# Altium project Blue Tractor_v1.1-2021.PrjPCB (part 2 of 2)

## Sheet [09] - EMC-Power.SchDoc
size A3; PageSetup: Record=PageOptions|CenterHorizontal=True|CenterVertical=True|PrintScale=0.94|XCorrection=1.00|YCorrection=1.00|PrintKind=1|BorderSize=5000000|LeftOffset=0|BottomOffset=0|Orientation=1|PaperLength=1000|PaperWidth=1000|Scale=100|PaperSource=7|PrintQuality=-4|MediaType=1|DitherType=10|PaperKind=A4|PrintScaleMode=1; DecimalNumber: Децимальный номер; HeadOfSector: Нач. сектора; MainDevice: Перв.примен.; Name: Наименование
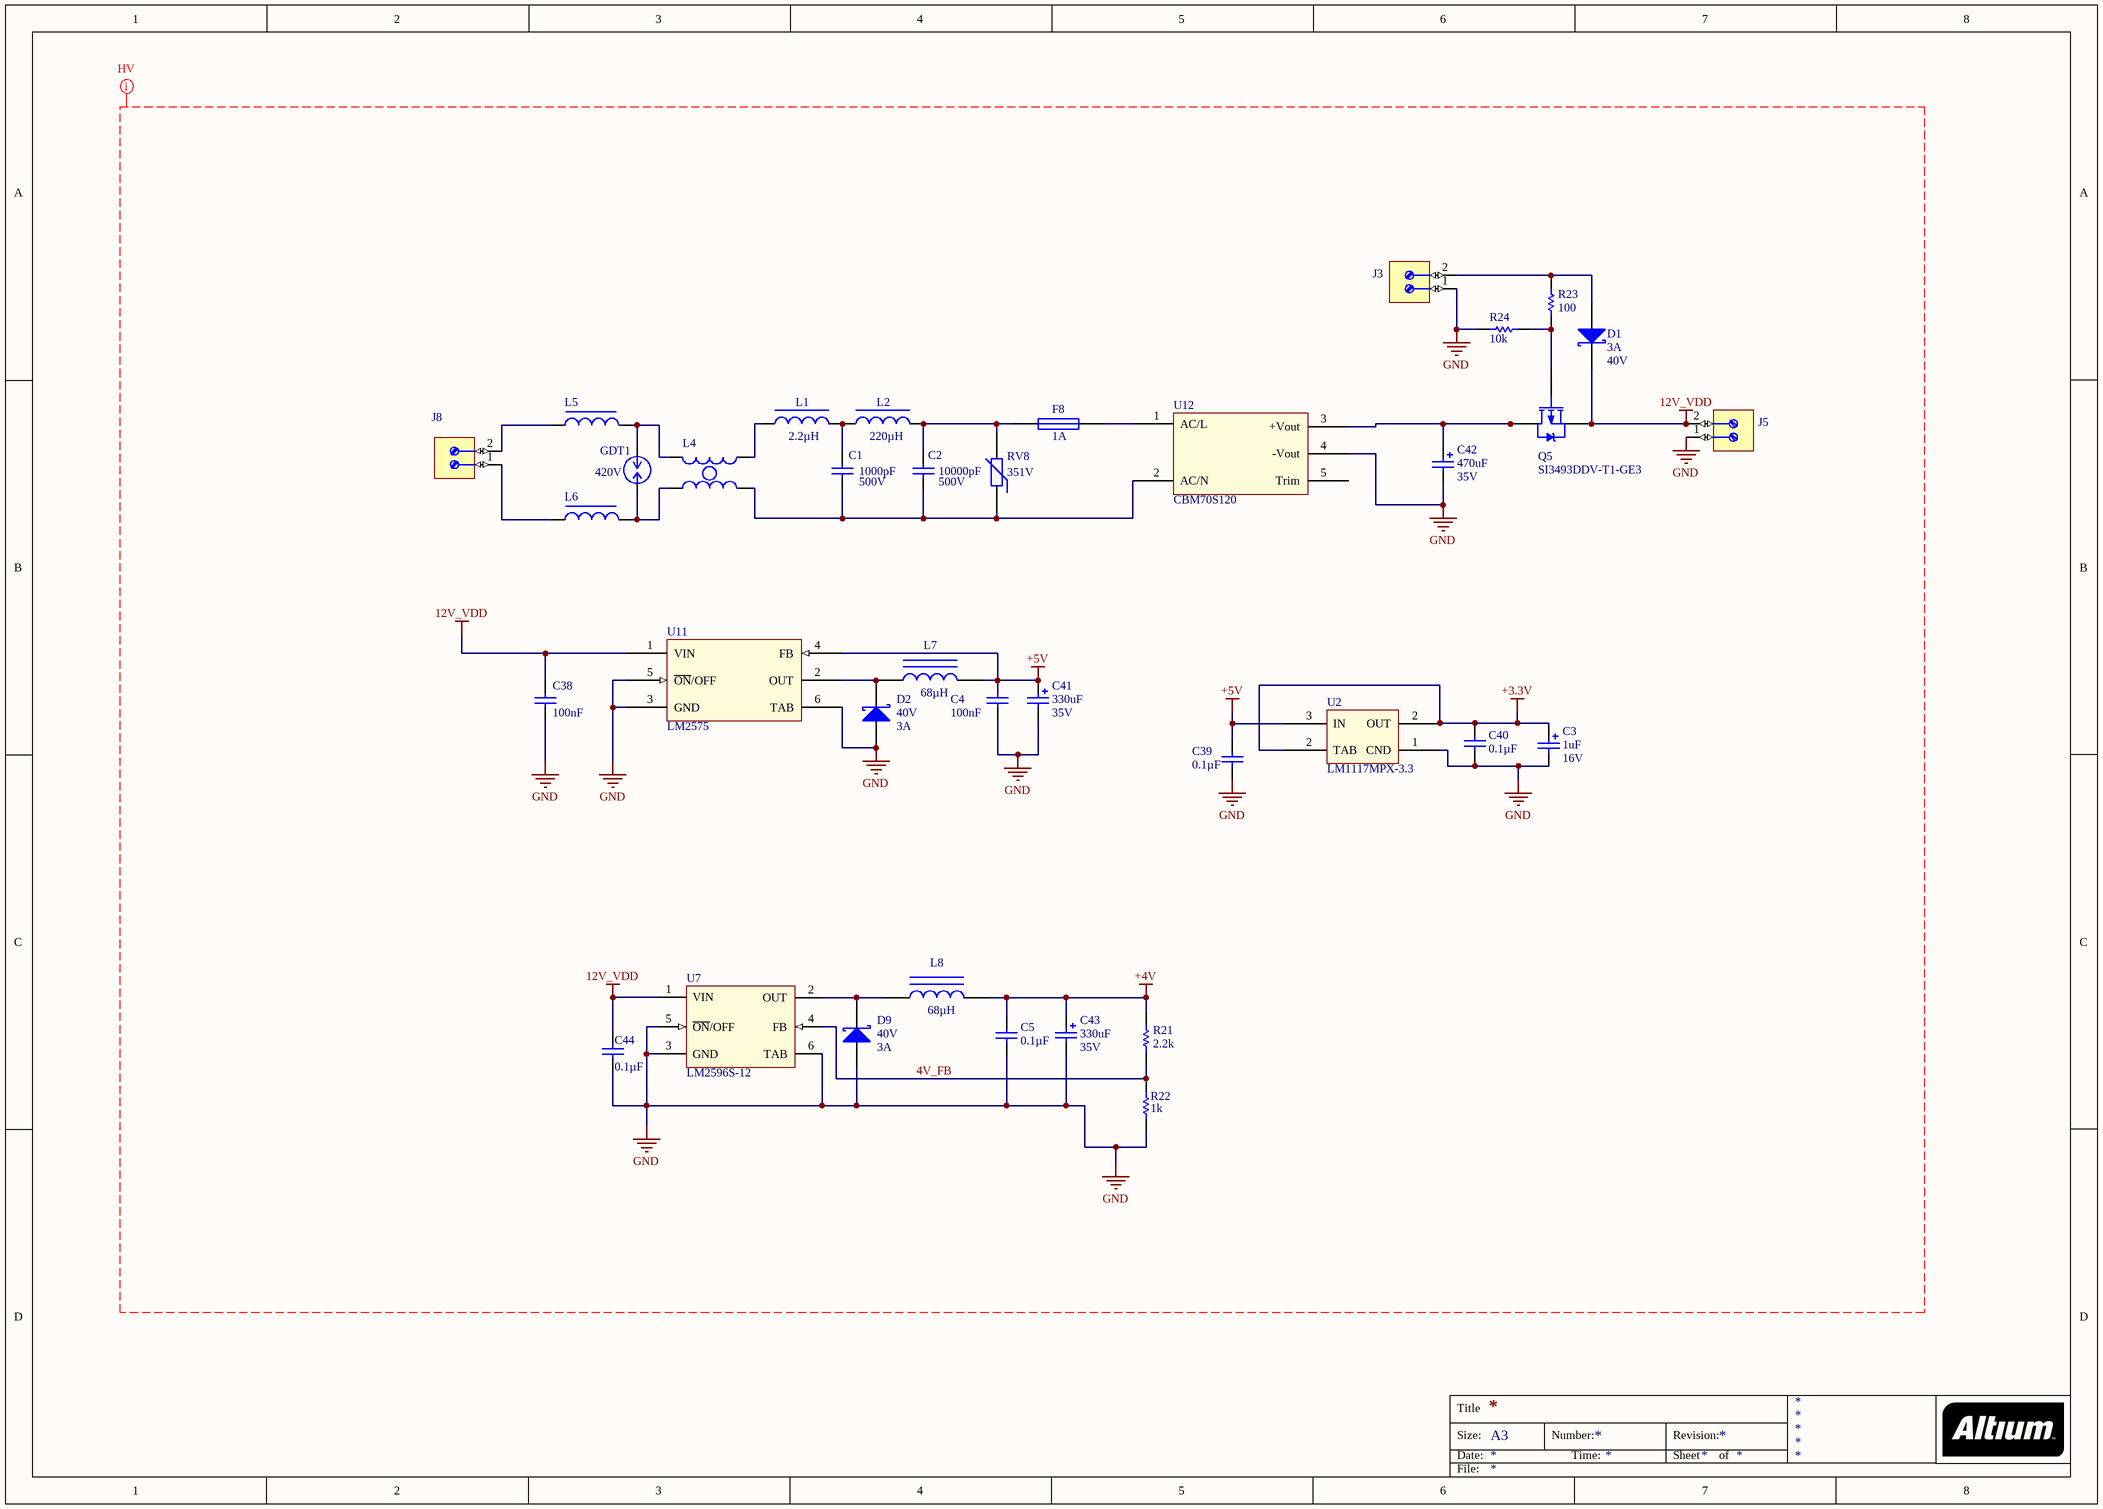
[diagram p5: [09] - EMC-Power.SchDoc]

### Parts
C1  Capacitance: 1000pF  Voltage - Rated: 500V  [CAPASITOR_1206]  (hidden comment: Capacitor)
C2  Capacitance: 10000pF  Voltage - Rated: 500V  [CAPASITOR_1206]  (hidden comment: Capacitor)
C3  Capacitance: 1uF  Voltage Rating: 16V  [Tantalum 3216 A]  (hidden comment: Capacitor Polarized)
C4  Capacitance: 100nF  [0603_C]  (hidden comment: Capacitor)
C5  Capacitance: 0.1µF  [0603_C]  (hidden comment: Capacitor)
C38  value 100nF  [0603_C]  (hidden comment: Capacitor)
C39  Capacitance: 0.1µF  [0603_C]  (hidden comment: Capacitor)
C40  Capacitance: 0.1µF  [0603_C]  (hidden comment: Capacitor)
C41  Capacitance: 330uF  Voltage: 35V  [Aluminium SMD G]  (hidden comment: Capacitor Polarized)
C42  Capacitance: 470uF  Voltage Rating: 35V  [Aluminium SMD G]  (hidden comment: Capacitor Polarized)
C43  Capacitance: 330uF  Voltage: 35V  [Aluminium SMD G]  (hidden comment: Capacitor Polarized)
C44  Capacitance: 0.1µF  [0603_C]  (hidden comment: Capacitor)
D1  Output Current: 3A  Voltage: 40V  [D-Schottky]  (hidden comment: SK32)
D2  Output Current: 3A  Voltage: 40V  [D-Schottky]  (hidden comment: SK32)
D9  Output Current: 3A  Voltage: 40V  [D-Schottky]  (hidden comment: SK32)
F8  value 1A  [FUSR_LITTELFUSE_2920L]  (hidden comment: Fuse)
GDT1  Voltage - DC Spark Over (Nom): 420V  [GTCA28_TYCO_TYC]  (hidden comment: Gas Discharge Tube)
J3  (no value)  [Connector -PHOENIX_1715721]
J5  (no value)  [Connector -PHOENIX_1715721]
J8  (no value)  [Connector -PHOENIX_1715721]
L1  Inductance: 2.2µH  [? INDUCTOR_TDK]  (hidden comment: Inductor)
L2  Inductance: 220µH  [L8 -INDUCTOR_BOURNS_SRR1260]  (hidden comment: Inductor)
L4  RN114-1-02 Current-compensated Chokes  [IND: RN152]  (value not drawn)
L5  Inductor_BFB20022-4B-RC-ND  [INDUCTOR FB20022]  (value not drawn)
L6  Inductor_BFB20022-4B-RC-ND  [INDUCTOR FB20022]  (value not drawn)
L7  Inductance: 68µH  [L8 -INDUCTOR_BOURNS_SRR1260]  (hidden comment: SRR1210)
L8  Inductance: 68µH  [L8 -INDUCTOR_BOURNS_SRR1260]  (hidden comment: SRR1210)
Q5  Manufacturer Part Number: SI3493DDV-T1-GE3  [SOT23-6]  (hidden comment: PMOSFET)
R21  Resistance: 2.2k  [0603_R]  (hidden comment: Res1)
R22  Resistance: 1k  [0603_R]  (hidden comment: Res1)
R23  Resistance: 100  [0603_R]  (hidden comment: Res1)
R24  Resistance: 10k  [0603_R]  (hidden comment: Res1)
RV8  Varistor Voltage (Min): 351V  [VARS_B72214S0271K101_TDK]  (hidden comment: Res Varistor)
U2  LM1117MPX-3.3  [LM1117IMPX-3.3]
U7  LM2596S-12  [TO-263-5]
U11  LM2575  [TO-263-5]
U12  CBM70S120  [MOD: CBM70S]

### Nets
12V_VDD: C38.2 C44.2 D1.2(K) J5.2 Q5.4(S) U7.1(VIN) U11.1(VIN)
+3.3V: C3.1 C40.2 U2.2(TAB)
+4V: C5.2 C43.1 L8.2 R21.1
+5V: C4.2 C39.2 C41.1 L7.2 U2.3(IN) U11.4(FB)
GND: C3.2 C4.1 C5.1 C38.1 C39.1 C40.1 C41.2 C42.2 C43.2 C44.1 D2.1(A) D9.1(A) J3.1 J5.1 R22.1 R24.2 U2.1(CND) U7.3(GND) U7.5(~{ON}/OFF) U7.6(TAB) U11.3(GND) U11.5(~{ON}/OFF) U11.6(TAB) U12.4(-Vout)
4V_FB: R21.2 R22.2 U7.4(FB)
NetC1_1: C1.1 C2.1 L4.2 RV8.1 U12.2(AC/N)
NetC1_2: C1.2 L1.2 L2.1
NetC2_2: C2.2 F8.1 L2.2 RV8.2
NetC42_1: C42.1 Q5.1(D) Q5.2(D) Q5.5(D) Q5.6(D) U12.3(+Vout)
NetD1_1: D1.1(A) J3.2 R23.1
NetD2_2: D2.2(K) L7.1 U11.2(OUT)
NetD9_2: D9.2(K) L8.1 U7.2(OUT)
NetF8_2: F8.2 U12.1(AC/L)
NetGDT1_1: GDT1.1 L4.3 L5.2
NetGDT1_2: GDT1.2 L4.1 L6.2
NetJ8_1: J8.1 L6.1
NetJ8_2: J8.2 L5.1
NetL1_1: L1.1 L4.4
NetQ5_3: Q5.3(G) R23.2 R24.1

Not connected (* = marked no-connect by the designer): U12 5(Trim)

### Layout directives
net class HV: 4V_FB, 12V_VDD, +3.3V, +4V, +5V, GND

### Notes on the sheet
- Title
- Size:
- Date:
- A3
- Number:
- Time:
- Revision:
- Sheet
- of
- File:

### Library data of the parts
C1 = 1: Chip Capacitor Nonpolar; Manufacturer: Samsung Electro-Mechanics America, Inc; Manufacturer Part Number: CL31B102KGFNFNE; ID: 1; Lybrary Path: Capacitors.SchLib; Tolerance: ±10%; Temperature Coefficient: X7R; Published: 8-Jun-2000; LatestRevisionDate: 17-Jul-2002; LatestRevisionNote: Re-released for DXP Platform.; PackageReference: RAD-0.3; Publisher: Altium Limited; PackageDescription: Radial Cap, Thru-Hole; 2 Leads; 0.3 in Pin Spacing; Supplier 1: Digi-Key; Supplier Part Number 1: 1276-3065-1-ND; RoHS: RoHS Compliant; Category: Capacitors; Stock 1: 2501; Pricing 1: 1=0.19, 10=0.126, 25=0.092, 100=0.0643, 500=0.0459, 1000=0.03902 (USD); Packaging: Cut Tape (CT); Mounting Type: Surface Mount, MLCC; Operating Temperature: -55°C ~ 125°C; Applications: General Purpose; Ratings: -; Package / Case: 1206 (3216 Metric); Size / Dimension: 0.126" L x 0.063" W (3.20mm x 1.60mm); Height - Seated (Max): -; Thickness (Max): 0.055" (1.40mm); Lead Spacing: -; Features: -; Lead Style: -; ComponentLink1URL: http://www.samsungsem.com/kr/front/downloadcms.do?path=/kr/support/product-search/mlcc/__icsFiles/afieldfile/2014/11/05&fileName=S_CL31B102KGFNFNE.pdf; ComponentLink1Description: http://www.samsungsem.com/kr/front/downloadcms.do?path=/kr/support/product-search/mlcc/__icsFiles/afieldfile/2014/11/05&fileName=S_CL31B102KGFNFNE.pdf
C2 = 1: Chip Capacitor Nonpolar; Manufacturer: Samsung Electro-Mechanics America, Inc; Manufacturer Part Number: CL31B103KGFNNNE; Tolerance: ±10%; Temperature Coefficient: X7R; Supplier 1: Digi-Key; Supplier Part Number 1: 1276-3076-1-ND; RoHS: RoHS Compliant; Category: Capacitors; Stock 1: 4460; Pricing 1: 1=0.26, 10=0.216, 25=0.1484, 100=0.108, 500=0.07156, 1000=0.06345 (USD); Packaging: Cut Tape (CT); Mounting Type: Surface Mount, MLCC; Operating Temperature: -55°C ~ 125°C; Applications: General Purpose; Ratings: -; Package / Case: 1206 (3216 Metric); Size / Dimension: 0.126" L x 0.063" W (3.20mm x 1.60mm); Height - Seated (Max): -; Thickness (Max): 0.055" (1.40mm); Lead Spacing: -; Features: -; Lead Style: -; ComponentLink1URL: http://www.samsungsem.com/kr/front/downloadcms.do?path=/kr/support/product-search/mlcc/__icsFiles/afieldfile/2014/11/05&fileName=S_CL31B103KGFNNNE.pdf; ComponentLink1Description: http://www.samsungsem.com/kr/front/downloadcms.do?path=/kr/support/product-search/mlcc/__icsFiles/afieldfile/2014/11/05&fileName=S_CL31B103KGFNNNE.pdf
C3 = 2: Tantalum Capacitor; Manufacturer: Vishay Sprague; Manufacturer Part Number: 293D105X9016A2TE3; Tolerance: 10%; ESR (Equivalent Series Resistance): 9.3R; Ripple Current: 90mA; Leakage Current: 500nA; Polarity: Polar; Dissipation Factor: 4%; ComponentLink1URL: http://www.kemet.com/Lists/ProductCatalog/Attachments/254/KEM_T2005_T491.pdf; ComponentLink1Description: http://www.kemet.com/Lists/ProductCatalog/Attachments/254/KEM_T2005_T491.pdf; Supplier 1: Digi-Key; Supplier Part Number 1: 718-1113-6-ND; Stock 1: 0; Pricing 1: 1=0.33, 10=0.228, 100=0.1369, 500=0.1027, 1000=0.08672 (USD); Mount: Surface Mount,PCB; Case/Package: 1206; Case Code (Metric): 3216; Case Code (Imperial): 1206; Dielectric Material: Tantalum; Min Operating Temperature: -55°C; Max Operating Temperature: 125°C; Packaging: Tape and Reel; Package Quantity: 1; Voltage Rating (DC): 16V; Termination: SMD/SMT; Voltage: 16V; Features: General Purpose; Length: 3.2mm; Height: 1.6mm; Width: 1.6mm; Height - Seated (Max): 0.071inch; Depth: 1.6mm; Radiation Hardening: No; REACH SVHC: Unknown; Lead Free: Lead Free; ComponentLink2URL: https://datasheet.ciiva.com/11793/0900766b80d97b37-11793487.pdf; ComponentLink2Description: https://datasheet.ciiva.com/11793/0900766b80d97b37-11793487.pdf; ComponentLink3URL: https://datasheet.ciiva.com/26328/453930-da-01-en-smd-kondensator-293d105x9016a2te3-2000st-26328789.pdf; ComponentLink3Description: https://datasheet.ciiva.com/26328/453930-da-01-en-smd-kondensator-293d105x9016a2te3-2000st-26328789.pdf; ComponentLink4URL: https://datasheet.ciiva.com/257/293d-257909.pdf; ComponentLink4Description: https://datasheet.ciiva.com/257/293d-257909.pdf; ComponentLink5URL: https://datasheet.ciiva.com/257/293d-257910.pdf; ComponentLink5Description: https://datasheet.ciiva.com/257/293d-257910.pdf; ComponentLink6URL: https://datasheet.ciiva.com/16199/293d-16199270.pdf; ComponentLink6Description: https://datasheet.ciiva.com/16199/293d-16199270.pdf; ComponentLink7URL: https://datasheet.ciiva.com/257/293d-257911.pdf; ComponentLink7Description: https://datasheet.ciiva.com/257/293d-257911.pdf; ComponentLink8URL: https://datasheet.ciiva.com/3003/293d-3003799.pdf; ComponentLink8Description: https://datasheet.ciiva.com/3003/293d-3003799.pdf; ComponentLink9URL: https://datasheet.ciiva.com/11244/293d-11244087.pdf; ComponentLink9Description: https://datasheet.ciiva.com/11244/293d-11244087.pdf; ComponentLink10URL: https://datasheet.ciiva.com/46382/1910915-46382039.pdf; ComponentLink10Description: https://datasheet.ciiva.com/46382/1910915-46382039.pdf; ComponentLink11URL: https://datasheet.ciiva.com/3003/293d-3003800.pdf; ComponentLink11Description: https://datasheet.ciiva.com/3003/293d-3003800.pdf; ComponentLink12URL: https://datasheet.ciiva.com/18445/70212567-18445480.pdf; ComponentLink12Description: https://datasheet.ciiva.com/18445/70212567-18445480.pdf; ComponentLink13URL: https://datasheet.ciiva.com/1463/438417-1463146.pdf; ComponentLink13Description: https://datasheet.ciiva.com/1463/438417-1463146.pdf; ComponentLink14URL: https://datasheet.ciiva.com/12884/293d-239871-12884475.pdf; ComponentLink14Description: https://datasheet.ciiva.com/12884/293d-239871-12884475.pdf; ComponentLink15URL: https://datasheet.ciiva.com/22695/438417-22695102.pdf; ComponentLink15Description: https://datasheet.ciiva.com/22695/438417-22695102.pdf; ComponentLink16URL: https://datasheet.ciiva.com/6071/1748031-6071279.pdf; ComponentLink16Description: https://datasheet.ciiva.com/6071/1748031-6071279.pdf
C4 C5 C39 C40 C44 = 1: Chip Capacitor Nonpolar; Manufacturer: Kemet; Manufacturer Part Number: C0603C104K5RACTU; Tolerance: ±10%; Voltage - Rated: 50V; Temperature Coefficient: X7R; Supplier 1: Digi-Key; Supplier Part Number 1: 399-5089-1-ND; RoHS: RoHS Compliant; Category: Capacitors; Stock 1: 3992655; Pricing 1: 1=0.1, 10=0.041, 50=0.0222, 100=0.0187, 250=0.01532, 500=0.0131, 1000=0.0102 (USD); Packaging: Cut Tape (CT); Mounting Type: Surface Mount, MLCC; Operating Temperature: -55°C ~ 125°C; Applications: General Purpose; Ratings: -; Package / Case: 0603 (1608 Metric); Size / Dimension: 0.063" L x 0.031" W (1.60mm x 0.80mm); Height - Seated (Max): -; Thickness (Max): 0.034" (0.87mm); Lead Spacing: -; Features: -; Lead Style: -; ComponentLink1URL: http://www.kemet.com/docfinder?Partnumber=C0603C104K5RACTU; ComponentLink1Description: http://www.kemet.com/docfinder?Partnumber=C0603C104K5RACTU
C38 = 1: Capacitor 0603; Manufacturer: Kemet; Manufacturer Part Number: C0603C473K5RACTU; Capacitance: 0.047µF; Tolerance: ±10%; Voltage - Rated: 50V; Temperature Coefficient: X7R; Supplier 1: Digi-Key; Supplier Part Number 1: 399-7933-1-ND; RoHS: RoHS Compliant; Category: Capacitors; Stock 1: 66523; Pricing 1: 1=0.1, 10=0.059, 25=0.0416, 50=0.0318, 100=0.0269, 250=0.02204, 1000=0.0144 (USD); Packaging: Cut Tape (CT); Mounting Type: Surface Mount, MLCC; Operating Temperature: -55°C ~ 125°C; Applications: General Purpose; Ratings: -; Package / Case: 0603 (1608 Metric); Size / Dimension: 0.063" L x 0.031" W (1.60mm x 0.80mm); Height - Seated (Max): -; Thickness (Max): 0.034" (0.87mm); Lead Spacing: -; Features: -; Lead Style: -; ComponentLink1URL: http://www.kemet.com/docfinder?Partnumber=C0603C473K5RACTU; ComponentLink1Description: http://www.kemet.com/docfinder?Partnumber=C0603C473K5RACTU
C41 C43 = 4: Aluminium SMD Capacitors; Manufacturer: Panasonic; Manufacturer Part Number: EEE-1VA331P; Ripple Current (AC): 350mA; Tolerance: 20%; Polarity: Polar; Life (Hours): 2000Hour; Leakage Current: 3uA; Supplier 1: Digi-Key; Supplier Part Number 1: PCE3959DKR-ND; Stock 1: 40084; Pricing 1: 1=0.65, 10=0.482, 100=0.3304 (USD); Mount: Surface Mount,PCB; Case/Package: Radial; Contact Plating: Tin; Min Operating Temperature: -40°C; Max Operating Temperature: 85°C; Voltage Rating: 35V; Packaging: Tape and Reel; Ripple Current: 350mA; Voltage Rating (DC): 35V; Package Quantity: 500; Termination: SMD/SMT; Diameter: 10mm; Length: 10.5mm; Height: 10.2mm; Height - Seated (Max): 0.402inch; Radiation Hardening: No; REACH SVHC: No SVHC; Lead Free: Lead Free; ComponentLink1URL: https://datasheet.ciiva.com/16389/aba0000ce2-16389541.pdf; ComponentLink1Description: https://datasheet.ciiva.com/16389/aba0000ce2-16389541.pdf; ComponentLink2URL: https://datasheet.ciiva.com/30235/11aba0000ce2-30235093.pdf; ComponentLink2Description: https://datasheet.ciiva.com/30235/11aba0000ce2-30235093.pdf; ComponentLink3URL: https://datasheet.ciiva.com/46374/aba0000ce2-46374421.pdf; ComponentLink3Description: https://datasheet.ciiva.com/46374/aba0000ce2-46374421.pdf; ComponentLink4URL: https://datasheet.ciiva.com/43470/aba0000ce2-43470694.pdf; ComponentLink4Description: https://datasheet.ciiva.com/43470/aba0000ce2-43470694.pdf; ComponentLink5URL: https://datasheet.ciiva.com/14593/70255710-14593929.pdf; ComponentLink5Description: https://datasheet.ciiva.com/14593/70255710-14593929.pdf; ComponentLink6URL: https://datasheet.ciiva.com/24025/aba0000ce2-40801-24025561.pdf; ComponentLink6Description: https://datasheet.ciiva.com/24025/aba0000ce2-40801-24025561.pdf; ComponentLink7URL: https://datasheet.ciiva.com/14599/70255710-14599770.pdf; ComponentLink7Description: https://datasheet.ciiva.com/14599/70255710-14599770.pdf; ComponentLink8URL: https://datasheet.ciiva.com/17534/aba0000ce2-17534540.pdf; ComponentLink8Description: https://datasheet.ciiva.com/17534/aba0000ce2-17534540.pdf; ComponentLink9URL: https://datasheet.ciiva.com/31414/aba0000ce2-31414702.pdf; ComponentLink9Description: https://datasheet.ciiva.com/31414/aba0000ce2-31414702.pdf
C42 = 4: Aluminium SMD Capacitors; Manufacturer: Nichicon; Manufacturer Part Number: UCL1V471MNL1GS; Tolerance: 20%; Ripple Current: 1.19A; Impedance: 60mR; Leakage Current: 3uA; Life (Hours): 2000Hour; Dissipation Factor: 0.12%; Supplier 1: Digi-Key; Supplier Part Number 1: 493-3961-6-ND; Stock 1: 25815; Pricing 1: 1=0.98, 10=0.747, 100=0.5345 (USD); Mount: Surface Mount; Case/Package: Radial; Number of Pins: 2; Material: Aluminium; Dielectric Material: Aluminium; Min Operating Temperature: -55°C; Max Operating Temperature: 105°C; Packaging: Tape and Reel; Package Quantity: 1; Voltage Rating (DC): 35V; Ripple Current (AC): 1.19A; Termination: SMD/SMT; Diameter: 10mm; Length: 13.5mm; Height: 13.5mm; Height - Seated (Max): 0.531inch; Radiation Hardening: No; REACH SVHC: No SVHC; Lead Free: Lead Free; ComponentLink1URL: https://datasheet.ciiva.com/30521/getdatasheetpartid-743876-30521937.pdf; ComponentLink1Description: https://datasheet.ciiva.com/30521/getdatasheetpartid-743876-30521937.pdf; ComponentLink2URL: https://datasheet.ciiva.com/98/e-cl-98467.pdf; ComponentLink2Description: https://datasheet.ciiva.com/98/e-cl-98467.pdf; ComponentLink3URL: https://datasheet.ciiva.com/98/e-cl-98468.pdf; ComponentLink3Description: https://datasheet.ciiva.com/98/e-cl-98468.pdf; ComponentLink4URL: https://datasheet.ciiva.com/98/e-cl-98469.pdf; ComponentLink4Description: https://datasheet.ciiva.com/98/e-cl-98469.pdf; ComponentLink5URL: https://datasheet.ciiva.com/22661/1910939-22661894.pdf; ComponentLink5Description: https://datasheet.ciiva.com/22661/1910939-22661894.pdf; ComponentLink6URL: https://datasheet.ciiva.com/28458/1910939-28458006.pdf; ComponentLink6Description: https://datasheet.ciiva.com/28458/1910939-28458006.pdf; ComponentLink7URL: https://datasheet.ciiva.com/6153/e-cl-6153975.pdf; ComponentLink7Description: https://datasheet.ciiva.com/6153/e-cl-6153975.pdf; ComponentLink8URL: https://datasheet.ciiva.com/11683/e-cl-11683743.pdf; ComponentLink8Description: https://datasheet.ciiva.com/11683/e-cl-11683743.pdf; ComponentLink9URL: https://datasheet.ciiva.com/16502/e-cl-16502287.pdf; ComponentLink9Description: https://datasheet.ciiva.com/16502/e-cl-16502287.pdf
D1 D2 D9 = SK32: Schottky Rectifier; Manufacturer: Diodes; Manufacturer Part Number: B340A-13-F; Peak Reverse Current: 500uA; Forward Voltage: 500mV; Max Forward Surge Current (Ifsm): 80A; Element Configuration: Single; Polarity: Standard; Capacitance: 250pF; ComponentLink1Description: Manufacturer Link; ComponentLink1URL: http://www.irf.com/; ComponentLink2Description: Datasheet; ComponentLink2URL: http://www.irf.com/product-info/datasheets/data/18tq.pdf; Supplier 1: Digi-Key; Supplier Part Number 1: B340A-FDIDKR-ND; Stock 1: 761735; Pricing 1: 1=0.46, 10=0.373, 100=0.2538, 500=0.19034, 1000=0.14276 (USD); Mount: Surface Mount; Case/Package: SMA; Number of Pins: 2; Weight: 0.002258oz; Contact Plating: Tin,Matte; Min Operating Temperature: -55°C; Max Operating Temperature: 125°C; Forward Current: 3A; Packaging: Tape and Reel; Package Quantity: 5000; Average Rectified Current: 3A; Max Repetitive Reverse Voltage (Vrrm): 40V; Peak Non-Repetitive Surge Current: 80A; Termination: SMD/SMT; Voltage Rating (DC): 40V; Current Rating: 3A; Current: 3A; Max Reverse Voltage (DC): 40V; Length: 4.6mm; Height: 2.3mm; Width: 2.92mm; Radiation Hardening: No; REACH SVHC: No SVHC; Lead Free: Lead Free; ComponentLink3URL: https://datasheet.ciiva.com/4245/861ds30891-4245763.pdf; ComponentLink3Description: https://datasheet.ciiva.com/4245/861ds30891-4245763.pdf; ComponentLink4URL: https://datasheet.ciiva.com/26949/getdatasheetpartid-143394-26949352.pdf; ComponentLink4Description: https://datasheet.ciiva.com/26949/getdatasheetpartid-143394-26949352.pdf; ComponentLink5URL: https://datasheet.ciiva.com/1177/ds30891-1177476.pdf; ComponentLink5Description: https://datasheet.ciiva.com/1177/ds30891-1177476.pdf; ComponentLink6URL: https://datasheet.ciiva.com/1240/ds30891-1240228.pdf; ComponentLink6Description: https://datasheet.ciiva.com/1240/ds30891-1240228.pdf; ComponentLink7URL: https://datasheet.ciiva.com/913/ds30891-913637.pdf; ComponentLink7Description: https://datasheet.ciiva.com/913/ds30891-913637.pdf; ComponentLink8URL: https://datasheet.ciiva.com/913/ds30891-913638.pdf; ComponentLink8Description: https://datasheet.ciiva.com/913/ds30891-913638.pdf; ComponentLink9URL: https://datasheet.ciiva.com/913/ds30891-913639.pdf; ComponentLink9Description: https://datasheet.ciiva.com/913/ds30891-913639.pdf; ComponentLink10URL: https://datasheet.ciiva.com/46393/1911813-46393773.pdf; ComponentLink10Description: https://datasheet.ciiva.com/46393/1911813-46393773.pdf
F8 = 12: Manufacturer: TE Connectivity Raychem Circuit Protection; Manufacturer Part Number: LVR100S; Voltage - Max: 240V; Current - Max: 10A; Current - Trip (It): 2A; R Min/Max: 0.200 ~ 0.330 Ohm; Time to Trip: 21s; Supplier 1: Digi-Key; Supplier Part Number 1: LVR100S-ND; RoHS: RoHS Compliant; Category: Circuit Protection; Stock 1: 4143; Pricing 1: 1=1.74, 10=1.54, 100=1.38, 500=1.18, 1000=1.12, 2000=1.09001, 5000=1.02, 10000=0.87 (USD); Packaging: Bulk; Current - Hold (Ih) (Max): 1A; Package / Case: Radial, Disc; ComponentLink1URL: http://www.te.com/commerce/DocumentDelivery/DDEController?Action=srchrtrv&DocNm=SCD26610&DocType=SS&DocLang=EN; ComponentLink1Description: http://www.te.com/commerce/DocumentDelivery/DDEController?Action=srchrtrv&DocNm=SCD26610&DocType=SS&DocLang=EN
GDT1 = Gas Discharge Tube: Manufacturer: TE Connectivity Raychem Circuit Protection; Manufacturer Part Number: GTCA28-421M-R05; Impulse Discharge Current (8/20µs): 5000A (5kA); Tolerance: ±20%; Number of Poles: 2; Fail Short: No; Supplier 1: Digi-Key; Supplier Part Number 1: GTCA28-421M-R05-ND; RoHS: RoHS Compliant; Category: Circuit Protection; Stock 1: 994; Pricing 1: 1=0.56, 10=0.517, 100=0.47, 500=0.3666, 1000=0.31584, 5000=0.28952, 10000=0.2444, 50000=0.235, 1000000=0.2256 (USD); Packaging: Tray; Mounting Type: Through Hole; Package / Case: Axial Cylinder; ComponentLink1URL: http://www.te.com/commerce/DocumentDelivery/DDEController?Action=srchrtrv&DocNm=SCD27654&DocType=SS&DocLang=EN; ComponentLink1Description: http://www.te.com/commerce/DocumentDelivery/DDEController?Action=srchrtrv&DocNm=SCD27654&DocType=SS&DocLang=EN
J3 J5 J8 = PHOENIX_1715721: Terminal Block, 2 Positions, Screw Connection; Part Description: 17.5A, 400V, Terminal Block, Pitch 5.08mm, 2 Positions, Screw Connection; Manufacturer: PHOENIX CONTACT; Manufacturer Part Number: 1715721 (MKDS 1,5/2-5,08); PressFit: No; Part Number: PHOENIX_1715721; Component Kind: Standard; Component Type: Standard; Footprint: PHOENIX_1715721; Pin Count: 2; Mounted: Yes; Socket: No; SMD: No; Sense: No; Status: None; ComponentHeight: 13.8mm; HelpURL: \\cern.ch\dfs\Applications\Altium\Datasheets\PHOENIX_1715721.pdf; Author: CERN DEM JLC; CreateDate: 06.01.2010; LatestRevisionDate: 25.02.2013
L1 = 5: Inductors throgh hole; Manufacturer: TDK Corporation; Manufacturer Part Number: VLS252012T-2R2M1R3; Type: Wirewound; Tolerance: ±20%; Current Rating: 1.3A; Current - Saturation: 1.8A; Shielding: Shielded; DC Resistance (DCR): 155 mOhm Max; Frequency - Test: 1MHz; Supplier 1: Digi-Key; Supplier Part Number 1: 445-3670-1-ND; RoHS: RoHS Compliant; Category: Inductors, Coils, Chokes; Stock 1: 12814; Pricing 1: 1=0.81, 10=0.72, 50=0.585, 100=0.54, 500=0.468, 1000=0.396 (USD); Packaging: Cut Tape (CT); Material - Core: -; Q @ Freq: -; Frequency - Self Resonant: -; Operating Temperature: -40°C ~ 105°C; Mounting Type: Surface Mount; Package / Case: 1008 (2520 Metric); Size / Dimension: 0.098" L x 0.079" W (2.50mm x 2.00mm); Height - Seated (Max): 0.039" (1.00mm); Supplier Device Package: 1008 (2520 Metric); ComponentLink1URL: http://media.digikey.com/pdf/Data%20Sheets/TDK%20PDFs/vls252012.pdf; ComponentLink1Description: http://media.digikey.com/pdf/Data%20Sheets/TDK%20PDFs/vls252012.pdf
L2 = 5: Inductors throgh hole; Manufacturer: Bourns Inc.; Manufacturer Part Number: SRR1260-221K; Type: Wirewound; Material - Core: Ferrite; Tolerance: ±10%; Current Rating: 1.38A; Current - Saturation: 1.3A; Shielding: Shielded; DC Resistance (DCR): 380 mOhm Max; Q @ Freq: 22 @ 796kHz; Frequency - Self Resonant: 4.2MHz; Frequency - Test: 100kHz; Supplier 1: Digi-Key; Supplier Part Number 1: SRR1260-221KCT-ND; RoHS: RoHS Compliant; Category: Inductors, Coils, Chokes; Stock 1: 9927; Pricing 1: 1=0.99, 10=0.93, 25=0.868, 50=0.744, 100=0.7068, 250=0.6448 (USD); Packaging: Cut Tape (CT); Operating Temperature: -40°C ~ 125°C; Mounting Type: Surface Mount; Package / Case: Nonstandard; Size / Dimension: 0.492" L x 0.492" W (12.50mm x 12.50mm); Height - Seated (Max): 0.256" (6.50mm); Supplier Device Package: -; ComponentLink1URL: http://www.bourns.com/data/global/pdfs/SRR1260.pdf; ComponentLink1Description: http://www.bourns.com/data/global/pdfs/SRR1260.pdf
L4 = RN114-1-02 Current-compensated Chokes: Manufacturer: Schaffner EMC Inc; Value: 10mH; ID: 1; Filter Type: Power Line; Number of Lines: 2; Inductance: 15mH; Current: 1A; DC Resistance (DCR): 375 mOhm; Supplier 1: Digi-Key; Supplier Part Number 1: 817-1539-ND; Manufacturer Part Number: RN114-1-02; RoHS: RoHS Compliant; Category: Filters; Stock 1: 4897; Pricing 1: 1=2.84, 10=2.599, 25=2.3624, 50=1.9846, 100=1.701, 250=1.60652, 500=1.512, 1000=1.4175, 2500=1.3965 (USD); Packaging: Tray; Impedance: -; Mounting Type: Through Hole; Size / Dimension: 0.886" L x 0.846" W (22.50mm x 21.50mm); Height (Max): 0.531" (13.50mm); Package / Case: Horizontal, 4 PC Pin; Operating Temperature: -40°C ~ 125°C; ComponentLink1URL: http://schaffner.com/en/products/datasheet-low-res/product/rn-series-common-mode-chokes.pdf; ComponentLink1Description: http://schaffner.com/en/products/datasheet-low-res/product/rn-series-common-mode-chokes.pdf
L5 L6 = Inductor_BFB20022-4B-RC-ND: BFB20022-4B-RC-ND
L7 L8 = SRR1210: Magnetic-Core Inductor; Manufacturer: Bourns Inc.; Manufacturer Part Number: SRR1210-680M; Type: Wirewound; Material - Core: Ferrite; Tolerance: ±20%; Current Rating: 3A; Current - Saturation: 2.7A; Shielding: Shielded; DC Resistance (DCR): 102 mOhm Max; Q @ Freq: 12 @ 2.52MHz; Frequency - Self Resonant: 3.8MHz; Frequency - Test: 100kHz; Value: 68µH; Published: 24-Mar-1999; LatestRevisionDate: 17-Jul-2002; LatestRevisionNote: Re-released for DXP Platform.; PackageReference: AXIAL-0.9; Publisher: Altium Limited; PackageDescription: Axial Device, Thru-Hole; 2 Leads; 0.9 in Pin Spacing; Supplier 1: Digi-Key; Supplier Part Number 1: SRR1210-680MCT-ND; RoHS: RoHS Compliant; Category: Inductors, Coils, Chokes; Stock 1: 2411; Pricing 1: 1=1.06, 10=0.99, 25=0.924, 50=0.792, 100=0.7524 (USD); Packaging: Cut Tape (CT); Operating Temperature: -40°C ~ 125°C; Mounting Type: Surface Mount; Package / Case: Non Standard; Size / Dimension: 0.472" L x 0.472" W (12.00mm x 12.00mm); Height - Seated (Max): 0.394" (10.00mm); Supplier Device Package: -; ComponentLink1URL: http://www.bourns.com/data/global/pdfs/SRR1210.pdf; ComponentLink1Description: http://www.bourns.com/data/global/pdfs/SRR1210.pdf
Q5 = PMOSFET: MOSFET P-CHANNEL 20V 8A 6TSOP; Manufacturer: Vishay; Rds On Max: 24mR; Input Capacitance: 1.825nF; Max Power Dissipation: 3.6W; Supplier 1: Digi-Key; Supplier Part Number 1: SI3493DDV-T1-GE3CT-ND; RoHS: Yes; Category: MOSFETs; Stock 1: 4252; Pricing 1: 1=0,37000, 10=0,29800, 25=0,27320, 100=0,17150, 500=0,15876, 1000=0,10795 (USD); Mount: Surface Mount; Case/Package: TSOP; Min Operating Temperature: -55°C; Max Operating Temperature: 150°C; Packaging: Tape and Reel; Drain to Source Voltage (Vdss): 20V; Continuous Drain Current (ID): 8A; ComponentLink1URL: http://www.vishay.com/docs/74735/si3493ddv.pdf?src-supplier=Digi-Key; ComponentLink1Description: http://www.vishay.com/docs/74735/si3493ddv.pdf?src-supplier=Digi-Key
R21 R23 R24 = 1: Chip Resistor; Manufacturer: Panasonic; Manufacturer Part Number: ERJ-3GEYJ222V; Power Rating: 100mW; Tolerance: 5%; Voltage Rating: 75V; Temperature Coefficient: 200ppm/°C; Voltage Rating (DC): 50V; ComponentLink1URL: https://datasheet.ciiva.com/11821/0900766b80f806dd-11821453.pdf; ComponentLink1Description: https://datasheet.ciiva.com/11821/0900766b80f806dd-11821453.pdf; ComponentLink2URL: https://datasheet.ciiva.com/34303/1988639-34303614.pdf; ComponentLink2Description: https://datasheet.ciiva.com/34303/1988639-34303614.pdf; ComponentLink3URL: https://datasheet.ciiva.com/16760/70255313-16760341.pdf; ComponentLink3Description: https://datasheet.ciiva.com/16760/70255313-16760341.pdf; ComponentLink4URL: https://datasheet.ciiva.com/9117/aoa0000ce1-9117127.pdf; ComponentLink4Description: https://datasheet.ciiva.com/9117/aoa0000ce1-9117127.pdf; ComponentLink5URL: https://datasheet.ciiva.com/46380/1500035-46380411.pdf; ComponentLink5Description: https://datasheet.ciiva.com/46380/1500035-46380411.pdf; ComponentLink6URL: https://datasheet.ciiva.com/16765/70255313-16765244.pdf; ComponentLink6Description: https://datasheet.ciiva.com/16765/70255313-16765244.pdf; ComponentLink7URL: https://datasheet.ciiva.com/16199/aoa0000ce1-16199902.pdf; ComponentLink7Description: https://datasheet.ciiva.com/16199/aoa0000ce1-16199902.pdf; ComponentLink8URL: https://datasheet.ciiva.com/16853/aoa0000ce1-16853407.pdf; ComponentLink8Description: https://datasheet.ciiva.com/16853/aoa0000ce1-16853407.pdf; ComponentLink9URL: https://datasheet.ciiva.com/22758/1500035-22758223.pdf; ComponentLink9Description: https://datasheet.ciiva.com/22758/1500035-22758223.pdf; ComponentLink10URL: https://datasheet.ciiva.com/28584/1678796-28584095.pdf; ComponentLink10Description: https://datasheet.ciiva.com/28584/1678796-28584095.pdf; Supplier 1: Digi-Key; Supplier Part Number 1: P2.2KGDKR-ND; Stock 1: 1578287; Pricing 1: 1=0.1, 10=0.054, 100=0.022, 1000=0.00988, 2500=0.00858 (USD); Mount: Surface Mount; Case/Package: 0603; Case Code (Imperial): 0603; Case Code (Metric): 1608; Contact Plating: Tin; Min Operating Temperature: -55°C; Max Operating Temperature: 155°C; Package Quantity: 1; Packaging: Tape and Reel; Composition: Thick Film; Number of Terminations: 2; Military Standard: Not; Termination: SMD/SMT; Max Power Dissipation: 100mW; Features: Automotive AEC-Q200; Working Voltage: 75V; Length: 1.6mm; Height: 0.45mm; Width: 0.8mm; Depth: 0.8mm; Radiation Hardening: No; REACH SVHC: No SVHC; Lead Free: Lead Free
R22 = 1: Chip Resistor; Manufacturer: Panasonic; Manufacturer Part Number: ERJ-3GEYJ102V; Power Rating: 100mW; Tolerance: 5%; Voltage Rating: 75V; Temperature Coefficient: 200ppm/°C; Voltage Rating (DC): 50V; Supplier 1: Digi-Key; Supplier Part Number 1: P1.0KGDKR-ND; Stock 1: 2655329; Pricing 1: 1=0.1, 10=0.054, 100=0.022, 1000=0.00988, 2500=0.00858 (USD); Mount: Surface Mount; Case/Package: 0603; Weight: 7.1E-05oz; Case Code (Metric): 1608; Case Code (Imperial): 0603; Contact Plating: Tin; Min Operating Temperature: -55°C; Max Operating Temperature: 155°C; Packaging: Tape and Reel; Package Quantity: 1; Composition: Thick Film; Number of Terminations: 2; Termination: SMD/SMT; Military Standard: Not; Max Power Dissipation: 100mW; Working Voltage: 75V; Features: Automotive AEC-Q200; Length: 1.6mm; Height: 0.45mm; Width: 0.031inch; Depth: 0.8mm; Radiation Hardening: No; REACH SVHC: No SVHC; Lead Free: Lead Free; ComponentLink1URL: https://datasheet.ciiva.com/11808/0900766b80f806dd-11808320.pdf; ComponentLink1Description: https://datasheet.ciiva.com/11808/0900766b80f806dd-11808320.pdf; ComponentLink2URL: https://datasheet.ciiva.com/34303/1988487-34303608.pdf; ComponentLink2Description: https://datasheet.ciiva.com/34303/1988487-34303608.pdf; ComponentLink3URL: https://datasheet.ciiva.com/16740/aoa0000ce1-16740759.pdf; ComponentLink3Description: https://datasheet.ciiva.com/16740/aoa0000ce1-16740759.pdf; ComponentLink4URL: https://datasheet.ciiva.com/30224/4aoa0000ce1-30224167.pdf; ComponentLink4Description: https://datasheet.ciiva.com/30224/4aoa0000ce1-30224167.pdf; ComponentLink5URL: https://datasheet.ciiva.com/24159/aoa0000ce1-37422-24159481.pdf; ComponentLink5Description: https://datasheet.ciiva.com/24159/aoa0000ce1-37422-24159481.pdf; ComponentLink6URL: https://datasheet.ciiva.com/16787/70255313-16787626.pdf; ComponentLink6Description: https://datasheet.ciiva.com/16787/70255313-16787626.pdf; ComponentLink7URL: https://datasheet.ciiva.com/43460/1678796-43460714.pdf; ComponentLink7Description: https://datasheet.ciiva.com/43460/1678796-43460714.pdf; ComponentLink8URL: https://datasheet.ciiva.com/46451/1678796-46451226.pdf; ComponentLink8Description: https://datasheet.ciiva.com/46451/1678796-46451226.pdf; ComponentLink9URL: https://datasheet.ciiva.com/9117/aoa0000ce1-9117035.pdf; ComponentLink9Description: https://datasheet.ciiva.com/9117/aoa0000ce1-9117035.pdf; ComponentLink10URL: https://datasheet.ciiva.com/46386/1678796-46386459.pdf; ComponentLink10Description: https://datasheet.ciiva.com/46386/1678796-46386459.pdf; ComponentLink11URL: https://datasheet.ciiva.com/48532/aoa0000ce1-48532155.pdf; ComponentLink11Description: https://datasheet.ciiva.com/48532/aoa0000ce1-48532155.pdf; ComponentLink12URL: https://datasheet.ciiva.com/22783/1678796-22783822.pdf; ComponentLink12Description: https://datasheet.ciiva.com/22783/1678796-22783822.pdf; ComponentLink13URL: https://datasheet.ciiva.com/28532/1678796-28532126.pdf; ComponentLink13Description: https://datasheet.ciiva.com/28532/1678796-28532126.pdf; ComponentLink14URL: https://datasheet.ciiva.com/46371/1678796-46371934.pdf; ComponentLink14Description: https://datasheet.ciiva.com/46371/1678796-46371934.pdf
RV8 = 11: Manufacturer: EPCOS Inc; Manufacturer Part Number: S14K250; ID: 11; Current - Surge: 4.5kA; Number of Circuits: 1; Maximum AC Volts: 250VAC; Maximum DC Volts: 320VDC; Energy: 65J; Published: 24-Mar-1999; LatestRevisionDate: 29-May-2009; LatestRevisionNote: IPC-7351 Footprint Added.; PackageVersion: Mar-2003; PackageReference: 6-0805; Publisher: Altium Limited; PackageDescription: Chip Resistor 0805 Case Size; Code_IPC: RESC2012; Supplier 1: Digi-Key; Supplier Part Number 1: 495-4375-ND; RoHS: RoHS Compliant; Category: Circuit Protection; Stock 1: 1402; Pricing 1: 1=0.64, 10=0.449, 100=0.2959, 500=0.2192, 1000=0.18632, 5000=0.1644, 10000=0.15344 (USD); Packaging: Bulk; Package / Case: Disc 14mm; ComponentLink1URL: http://www.epcos.com/inf/70/db/var_11/SIOV_Leaded_StandarD.pdf; ComponentLink1Description: http://www.epcos.com/inf/70/db/var_11/SIOV_Leaded_StandarD.pdf
U12 = CBM70S120: AC-DC ~230-12

## Sheet [12] - RTC.SchDoc
size A4; Organization: Altium Limited; Address1: L3, 12a Rodborough Rd; Address2: Frenchs Forest; Address3: NSW; Address4: Australia 2086
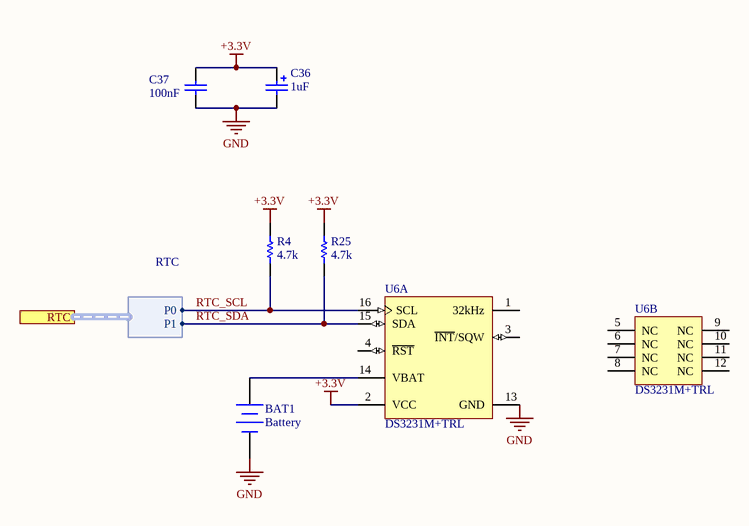
[diagram p6: [12] - RTC.SchDoc]

### Parts
BAT1  Battery  [Bat]
C36  Capacitance: 1uF  [Tantalum 3216 A]  (hidden comment: Capacitor Polarized)
C37  Capacitance: 100nF  [0603_C]  (hidden comment: Capacitor)
R4  Resistance: 4.7k  [Res-0603]  (hidden comment: Res1)
R25  Resistance: 4.7k  [Res-0603]  (hidden comment: Res1)
U6  DS3231M+TRL  [W16MK+1_N]  (parts A,B of 2)

### Ports
RTC (harness RTC)

### Harnesses
RTC: P0, P1

### Nets
+3.3V: C36.1 C37.2 R4.1 R25.1 U6.2(VCC)
GND: BAT1.2(-) C36.2 C37.1 U6.13(GND)
RTC_SCL: R4.2 U6.16(SCL) ; port RTC.P0
RTC_SDA: R25.2 U6.15(SDA) ; port RTC.P1
NetBAT1_1: BAT1.1(+) U6.14(VBAT)

Not connected (* = marked no-connect by the designer): U6 1(32kHz) 3(~{INT}/SQW) 4(~{RST}) 5(NC) 6(NC) 7(NC) 8(NC) 9(NC) 10(NC) 11(NC) 12(NC)

### Notes on the sheet
- Title
- Size:
- Date:
- A4
- Number:
- Time:
- Revision:
- Sheet
- of
- File:

### Library data of the parts
BAT1 = Battery: Multicell Battery; Published: 24-Mar-1999; LatestRevisionDate: 17-Jul-2002; LatestRevisionNote: Re-released for DXP Platform.; PackageReference: BAT-2; Publisher: Altium Limited; PackageDescription: Battery; 2 Leads
C36 = 4: Aluminium SMD Capacitors; Manufacturer: Panasonic; Manufacturer Part Number: EEE-1VA331P; Voltage Rating: 35V; Ripple Current (AC): 350mA; Tolerance: 20%; Polarity: Polar; Life (Hours): 2000Hour; Leakage Current: 3uA; Supplier 1: Digi-Key; Supplier Part Number 1: PCE3959DKR-ND; Stock 1: 40084; Pricing 1: 1=0.65, 10=0.482, 100=0.3304 (USD); Mount: Surface Mount,PCB; Case/Package: Radial; Contact Plating: Tin; Min Operating Temperature: -40°C; Max Operating Temperature: 85°C; Packaging: Tape and Reel; Ripple Current: 350mA; Voltage Rating (DC): 35V; Package Quantity: 500; Termination: SMD/SMT; Diameter: 10mm; Length: 10.5mm; Height: 10.2mm; Height - Seated (Max): 0.402inch; Radiation Hardening: No; REACH SVHC: No SVHC; Lead Free: Lead Free; ComponentLink1URL: https://datasheet.ciiva.com/16389/aba0000ce2-16389541.pdf; ComponentLink1Description: https://datasheet.ciiva.com/16389/aba0000ce2-16389541.pdf; ComponentLink2URL: https://datasheet.ciiva.com/30235/11aba0000ce2-30235093.pdf; ComponentLink2Description: https://datasheet.ciiva.com/30235/11aba0000ce2-30235093.pdf; ComponentLink3URL: https://datasheet.ciiva.com/46374/aba0000ce2-46374421.pdf; ComponentLink3Description: https://datasheet.ciiva.com/46374/aba0000ce2-46374421.pdf; ComponentLink4URL: https://datasheet.ciiva.com/43470/aba0000ce2-43470694.pdf; ComponentLink4Description: https://datasheet.ciiva.com/43470/aba0000ce2-43470694.pdf; ComponentLink5URL: https://datasheet.ciiva.com/14593/70255710-14593929.pdf; ComponentLink5Description: https://datasheet.ciiva.com/14593/70255710-14593929.pdf; ComponentLink6URL: https://datasheet.ciiva.com/24025/aba0000ce2-40801-24025561.pdf; ComponentLink6Description: https://datasheet.ciiva.com/24025/aba0000ce2-40801-24025561.pdf; ComponentLink7URL: https://datasheet.ciiva.com/14599/70255710-14599770.pdf; ComponentLink7Description: https://datasheet.ciiva.com/14599/70255710-14599770.pdf; ComponentLink8URL: https://datasheet.ciiva.com/17534/aba0000ce2-17534540.pdf; ComponentLink8Description: https://datasheet.ciiva.com/17534/aba0000ce2-17534540.pdf; ComponentLink9URL: https://datasheet.ciiva.com/31414/aba0000ce2-31414702.pdf; ComponentLink9Description: https://datasheet.ciiva.com/31414/aba0000ce2-31414702.pdf
C37 = 1: Chip Capacitor Nonpolar; Manufacturer: Samsung; Manufacturer Part Number: CL10B104KB8NNNC; Material: Ceramic; Dielectric: X7R; Tolerance: 10%; Voltage Rating: 50V; ComponentLink1URL: http://www.kemet.com/docfinder?Partnumber=C0603C104K5RACTU; ComponentLink1Description: http://www.kemet.com/docfinder?Partnumber=C0603C104K5RACTU; Supplier 1: Digi-Key; Supplier Part Number 1: 1276-1000-1-ND; RoHS: Yes; Stock 1: 17762403; Pricing 1: 1 = 0,10000, 10 = 0,02800, 100 = 0,01230, 500 = 0,00878, 1000 = 0,00690 (USD); Mount: Surface Mount; Case/Package: 0603; Case Code (Metric): 1608; Case Code (Imperial): 0603; Contact Plating: Tin; Min Operating Temperature: -55°C; Max Operating Temperature: 125°C; Package Quantity: 1; Packaging: Tape and Reel; Voltage: 50V; Voltage Rating (DC): 50V; Length: 1.6mm; Height: 0.8mm; Depth: 0.8mm; Width: 0.031inch; Thickness: 0.035inch; Radiation Hardening: No; Lead Free: Lead Free; ComponentLink2URL: https://datasheet.ciiva.com/25803/cl10b104kb8nnnc-25803393.pdf?src-supplier=Digi-Key; ComponentLink2Description: https://datasheet.ciiva.com/25803/cl10b104kb8nnnc-25803393.pdf?src-supplier=Digi-Key; ComponentLink3URL: https://datasheet.ciiva.com/26838/getdatasheetpartid-89097-26838411.pdf?src-supplier=Verical; ComponentLink3Description: https://datasheet.ciiva.com/26838/getdatasheetpartid-89097-26838411.pdf?src-supplier=Verical; ComponentLink4URL: https://datasheet.ciiva.com/29198/456651-da-01-en-vs-kondensator-0605-29198839.pdf?src-supplier=Conrad; ComponentLink4Description: https://datasheet.ciiva.com/29198/456651-da-01-en-vs-kondensator-0605-29198839.pdf?src-supplier=Conrad
R4 R25 = 1: as R21 on sheet [09] - EMC-Power; ComponentLink1URL: https://datasheet.ciiva.com/11821/0900766b80f806dd-11821453.pdf; ComponentLink1Description: https://datasheet.ciiva.com/11821/0900766b80f806dd-11821453.pdf; ComponentLink2URL: https://datasheet.ciiva.com/34303/1988639-34303614.pdf; ComponentLink2Description: https://datasheet.ciiva.com/34303/1988639-34303614.pdf; ComponentLink3URL: https://datasheet.ciiva.com/16760/70255313-16760341.pdf; ComponentLink3Description: https://datasheet.ciiva.com/16760/70255313-16760341.pdf; ComponentLink4URL: https://datasheet.ciiva.com/9117/aoa0000ce1-9117127.pdf; ComponentLink4Description: https://datasheet.ciiva.com/9117/aoa0000ce1-9117127.pdf; ComponentLink5URL: https://datasheet.ciiva.com/46380/1500035-46380411.pdf; ComponentLink5Description: https://datasheet.ciiva.com/46380/1500035-46380411.pdf; ComponentLink6URL: https://datasheet.ciiva.com/16765/70255313-16765244.pdf; ComponentLink6Description: https://datasheet.ciiva.com/16765/70255313-16765244.pdf; ComponentLink7URL: https://datasheet.ciiva.com/16199/aoa0000ce1-16199902.pdf; ComponentLink7Description: https://datasheet.ciiva.com/16199/aoa0000ce1-16199902.pdf; ComponentLink8URL: https://datasheet.ciiva.com/16853/aoa0000ce1-16853407.pdf; ComponentLink8Description: https://datasheet.ciiva.com/16853/aoa0000ce1-16853407.pdf; ComponentLink9URL: https://datasheet.ciiva.com/22758/1500035-22758223.pdf; ComponentLink9Description: https://datasheet.ciiva.com/22758/1500035-22758223.pdf; ComponentLink10URL: https://datasheet.ciiva.com/28584/1678796-28584095.pdf; ComponentLink10Description: https://datasheet.ciiva.com/28584/1678796-28584095.pdf; Supplier 1: Digi-Key; Supplier Part Number 1: P2.2KGDKR-ND; Stock 1: 1578287; Pricing 1: 1=0.1, 10=0.054, 100=0.022, 1000=0.00988, 2500=0.00858 (USD); Mount: Surface Mount; Case/Package: 0603; Case Code (Imperial): 0603; Case Code (Metric): 1608; Contact Plating: Tin; Min Operating Temperature: -55°C; Max Operating Temperature: 155°C; Package Quantity: 1; Packaging: Tape and Reel; Composition: Thick Film; Number of Terminations: 2; Military Standard: Not; Termination: SMD/SMT; Max Power Dissipation: 100mW; Features: Automotive AEC-Q200; Working Voltage: 75V; Length: 1.6mm; Height: 0.45mm; Width: 0.8mm; Depth: 0.8mm; Radiation Hardening: No; REACH SVHC: No SVHC; Lead Free: Lead Free
U6 = DS3231M-IL16-RTC: +/-5ppm, MEMS based Real-Time Clock, I2C Interface, 16-Pin SO, -40 to 85 degC, Pb-Free, Reel; ComponentLink2URL: http://datasheets.maxim-ic.com/en/ds/DS3231M.pdf; PackageVersion: revD, 2010; ComponentLink3Description: Package Specification; Code_JEDEC: MS-013-AA; PackageDescription: 16-Pin Small-Outline IC, Wide (0.3in), 1.27 mm Pitch, SOIC (W), Pb-Free; ComponentLink1Description: Manufacturer URL; DatasheetVersion: Rev 3, Dec-2011; Code_IPC: SOIC127P1030-16; ComponentLink3URL: http://pdfserv.maxim-ic.com/package_dwgs/21-0042.PDF; PackageReference: W16MK+1; ComponentLink1URL: http://www.maxim-ic.com; ComponentLink2Description: Datasheet

## Nets that join several sheets
+3.3V: [03] - WiFi (C9.1 C32.2 M1.3 P3.1), [05] - Sensors (R42.2), [06] - IO_Ports (P2.2 P2.4), [07] - SD (7 pins), [09] - EMC-Power (C3.1 C40.2 U2.2), [12] - RTC (5 pins)
+4V: [02] - GSM (7 pins), [09] - EMC-Power (C5.2 C43.1 L8.2 R21.1)
GND: [02] - GSM (31 pins), [03] - WiFi (28 pins), [05] - Sensors (BK1.1), [06] - IO_Ports (P2.6 P2.8), [07] - SD (C64.1 XS2.6 XS2.9 XS2.10), [09] - EMC-Power (24 pins), [12] - RTC (BAT1.2 C36.2 C37.1 U6.13)